# EasyEDA Pro project 鱼缸控制器(e-ink).epro, board Epad_C01_0603
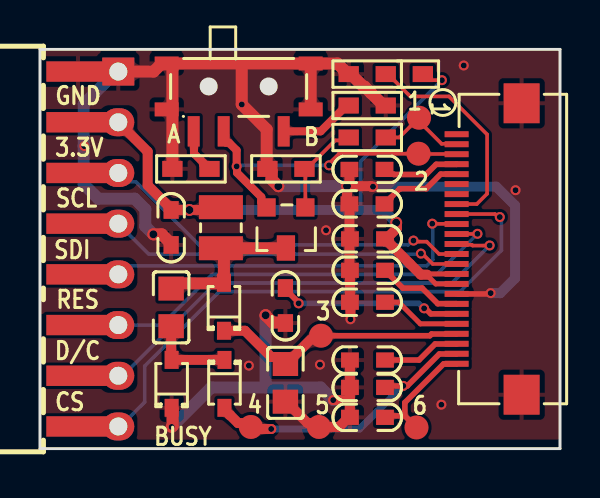
[diagram p8: board, top side]
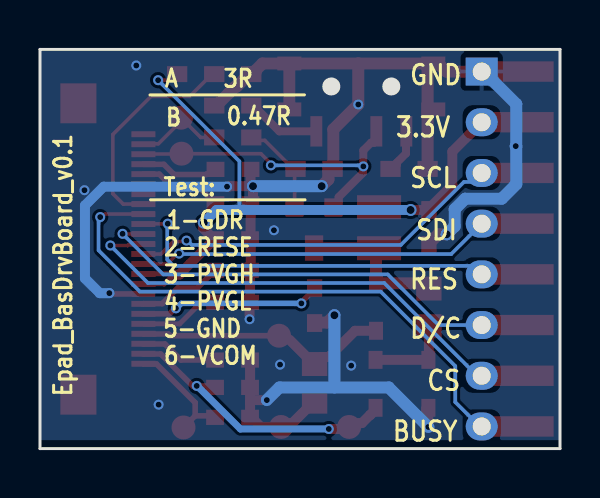
[diagram p9: board, bottom side, seen from below]

Outline 26 x 20 mm; copper layers: Top Layer, Bottom Layer. Coordinates in mm from the lower left corner of the outline.
Outline path: 0,20 0,0 26,0 26,20 0,20
Stack: Top Layer 0.0356mm / Dielectric 1 0.32mm FR-4 er 4.8 / Bottom Layer 0.0356mm

## Design rules (mm)
spacing safeClearance (default): track to track 0.25, other pairs 0 to 0.45
spacing BoardOutlineClearance: track to track 0.25, other pairs 0 to 0.45
spacing Clearance: track to track 0.25, other pairs 0 to 0.45
spacing Clearance_1: track to track 0.33, other pairs 0 to 0.45
spacing Clearance_2: track to track 0.33, other pairs 0 to 0.45
spacing Clearance_Room_LQFP: track to track 0.2, other pairs 0 to 0.45
spacing Clearance_Room_USB: track to track 0.2, other pairs 0 to 0.45
spacing Clearance_Room_FPC1: track to track 0.2, other pairs 0 to 0.45
track width Width (default): min 0.15, default 0.18, max 1
differential pair DiffPairsRouting (default): width min 0.381, default 0.381, max 0.381; gap min 0.254, default 0.254
via RoutingVias (default): diameter min 0.5, default 0.5, max 1; hole min 0.3, default 0.3, max 0.8

## Placement (name value [footprint] x y rotation side)
C1  1uF / NC  [C_մƬ(MLCC)_0603]  16.36 13.99 0 top
C2  1uF  [C_մƬ(MLCC)_0603]  16.36 12.26 0 top
C3  4.7uF 25V  [C_մƬ(MLCC)_0805]  6.56 7.08 90 top
C4  10uF  [C_մƬ(MLCC)_0603]  6.56 11.07 270 top
C5  4.7uF 25V  [C_մƬ(MLCC)_0805]  12.27 3.29 90 top
C6  1uF  [C_մƬ(MLCC)_0603]  16.36 10.51 180 top
C7  1uF  [C_մƬ(MLCC)_0603]  16.36 8.93 180 top
C8  1uF / NC  [C_մƬ(MLCC)_0603]  12.27 7.15 270 top
C9  1uF  [C_մƬ(MLCC)_0603]  16.36 7.33 180 top
C10  1uF  [C_մƬ(MLCC)_0603]  16.36 4.44 180 top
C11  1uF  [C_մƬ(MLCC)_0603]  16.36 3.06 180 top
C12  1uF  [C_մƬ(MLCC)_0603]  16.36 1.57 180 top
CN1  CN_FPC_24P  [CN_FPC_24P_0.5MM_½]  22.46 10 90 top
D1  MBR0530  [SOD-323]  9.22 3.24 270 top
D2  MBR0530  [SOD-323]  6.58 3.24 90 top
D3  MBR0530  [SOD-323]  9.2 7.1 90 top
J1  单排排针  [J__2.54_8x1P_SMD_]  1.9 10 270 top
J3  单排排针  [HDR-1X8(Pad_RR_1.4*1.6)]  3.91 18.89 270 top
L1  10uH 1A  [L_΢͹_2.5*2.0*1.2MM]  9.05 11.07 90 top
PAD1  0603  [Pad_ߺ_0603]  18.22 18.76 180 top
Q1  Si1308EDL  [SOT23-3(BHC)]  12.3 11.07 90 top
R1  3R  [R_Ƭ_0603]  16.36 18.76 0 top
R2  3R  [R_Ƭ_0603]  16.36 15.59 180 top
R3  10K  [R_Ƭ_0603]  12.3 14.01 0 top
R4  3R  [R_Ƭ_0603]  7.55 14.01 0 top
R5  0.47R  [R_Ƭ_0603]  16.36 17.19 180 top
SW1  SW_拨动开关_1P侧拨_SMD  [SW_ದ_SMD_MSK12CO2-SZ]  9.93 17.59 180 top
T1  TP-Pad圆点-TestPad  [TP-PadԲ_1.2_˿ӡ]  18.95 16.58 0 top
T2  TP-Pad圆点-TestPad  [TP-PadԲ_1.2_˿ӡ]  18.93 14.77 0 top
T3  TP-Pad圆点-TestPad  [TP-PadԲ_1.2_˿ӡ]  10.54 1.08 0 top
T4  TP-Pad圆点-TestPad  [TP-PadԲ_1.2_˿ӡ]  14.05 5.66 0 top
T5  TP-Pad圆点-TestPad  [TP-PadԲ_1.2_˿ӡ]  18.82 1.06 0 top
T6  TP-Pad圆点-TestPad  [TP-PadԲ_1.2_˿ӡ]  13.95 1.08 0 top

## Footprints (pads in the part's own frame, mm; a bottom-side part is the same pattern mirrored in y, then rotated)
C_մƬ(MLCC)_0603
  rect 0.889x0.762 smd: 1(-0.889,0) 2(0.864,0)
C_մƬ(MLCC)_0805
  rect 1.2x1.27 smd: 1(-0.943,0) 2(0.943,0)
CN_FPC_24P_0.5MM_½
  rect 0.3x1.2 smd: 1(5.75,1.625) 2(5.25,1.625) 3(4.75,1.625) 4(4.25,1.625) 5(3.75,1.625) 6(3.25,1.625) 7(2.75,1.625) 8(2.25,1.625) 9(1.75,1.625) 10(1.25,1.625) 11(0.75,1.625) 12(0.25,1.625) 13(-0.25,1.625) 14(-0.75,1.625) 15(-1.25,1.625) 16(-1.75,1.625) 17(-2.25,1.625) 18(-2.75,1.625) 19(-3.25,1.625) 20(-3.75,1.625) 21(-4.25,1.625) 22(-4.75,1.625) 23(-5.25,1.625) 24(-5.75,1.625)
  rect 2x1.8 smd: 25(-7.3,-1.625) 26(7.3,-1.625)
HDR-1X8(Pad_RR_1.4*1.6)
  rect 1.4x1.6 hole 0.9: 1(0,0)
  rrect 1.4x1.6 hole 0.9: 2(2.54,0) 3(5.08,0) 4(7.62,0) 5(10.16,0) 6(12.7,0) 7(15.24,0) 8(17.78,0)
J__2.54_8x1P_SMD_
  rect 1.02x3.17 smd: 1(-8.89,0) 2(-6.35,0) 3(-3.81,0) 4(-1.27,0) 5(1.27,0) 6(3.81,0) 7(6.35,0) 8(8.89,0)
L_΢͹_2.5*2.0*1.2MM
  rect 1.2x2.2 smd: 1(1.028,0) 2(-1.028,0)
Pad_ߺ_0603
  rect 1.016x0.8 smd: 1(-0.927,0)
R_Ƭ_0603
  rect 1.016x0.8 smd: 1(-0.927,0) 2(0.927,0)
SOD-323
  rect 0.899x0.701 smd: 1(1.2,0) 2(-1.2,0)
SOT23-3(BHC)
  rect 0.914x0.914 smd: 1(1.016,-0.971) 2(1.016,0.971)
  rect 1.27x0.914 smd: 3(-1.016,0)
SW_ದ_SMD_MSK12CO2-SZ
  rect 0.6x1.524 smd: 1(-2.25,1.7) 2(0.75,1.7) 3(2.25,1.7)
  rect 1.2x0.7 smd: 4(-3.6,0.6) 4(-3.6,-1.7) 4(3.6,0.6) 4(3.6,-1.7)
TP-PadԲ_1.2_˿ӡ
  round 1.2 smd: 1(0,0)

## Nets
As in the schematic.

Pads without a net: CN1 1 6 7

## Via types
v1: diameter 0.5, hole 0.3, Top Layer to Bottom Layer, 26 vias
v2: diameter 0.6, hole 0.4, Top Layer to Bottom Layer, 6 vias

## Routing (per net, layer and track width the routed paths; a pad name or vN(x,y) marks a point on that pad's centre or on a via; arc(x,y) is an arc through that point)
GND: length 90.8
  Top Layer w0.28: CN1.17 22.44,7.75
  Top Layer w0.3: 22.44,7.75 22.48,7.79 v1(22.53,7.79)
  Top Layer w0.5: 15.5,2.32 C12.2 15.43,1.57 14.95,1.08 T6.1 13.75,1.28 13.38,1.28 12.31,2.35 C5.1 ; 15.5,2.32 C11.2 C10.2 ; 15.5,2.32 15.38,2.43 v1(14.66,2.43) ; 15.47,13.15 16.53,13.15 16.56,13.12 v1(16.65,13.12) ; 15.47,13.15 v2(15.35,13.15) 15.35,12.38 C2.1 15.47,8.96 C7.2 C9.2 15.52,7.31 15.52,6.68 ; 15.47,13.15 C1.1
  Top Layer w0.6: C8.2 12.25,6.32 11.63,6.32 11.28,6.67 v2(11.28,6.68) ; R4.1 6.62,19.24 6.57,19.29 ; SW1.4 14.87,19.29 15.23,18.94 15.23,18.86 15.33,18.76 R1.1 15.54,18.76 16.17,18.14 16.23,18.14 16.55,17.81 16.56,17.81 17.18,17.19 R5.1 ; SW1.4 SW1.4 ; SW1.4 10.09,19.29 ; 10.09,19.29 6.57,19.29 ; 10.09,19.29 v1(10.09,17.24) 11.33,15.99 11.33,14.05 R3.1 11.48,14.01 11.58,13.91 11.58,13.49 v2(11.92,13.15) ; v1(6.58,1.08) 6.63,1.13 6.63,1.99 D2.2 ; 6.57,19.29 SW1.4 6.08,19.29 5.68,18.89 J3.1 ; v2(5.67,10.74) 6.09,10.74 6.56,10.27 C4.2
  Bottom Layer w0.5: v1(16.65,13.12) 22.81,13.12 23.75,12.18 23.75,8.53 23.02,7.79 v1(22.53,7.79)
  Bottom Layer w0.6: 11.28,3.06 v2(11.28,6.68) ; 11.28,3.06 8.56,3.06 v1(6.58,1.08) ; 11.28,3.06 14.02,3.06 v1(14.66,2.43) ; v2(11.92,13.15) v2(15.35,13.15) ; v2(5.67,10.74) 5.26,11.14 5.26,11.99 4.74,12.52 2.91,12.52 2.19,13.25 2.19,15.13 v1(2.21,15.16) 2.19,15.18 2.19,17.26 3.81,18.89 J3.1
  vias: v1(10.44,4.16) v1(14,4.21) v1(14.3,10.94) v1(15.52,6.48) v1(20.07,2.2) v1(21.19,19.19) v1(23.78,12.95)
VCC3.3: length 35.2
  Top Layer w0.18: PAD1.1 19.45,18.46 v1(20.09,18.46)
  Top Layer w0.25: CN1.16 19.79,8.25 19.36,8.68 19.43,8.75 CN1.15
  Top Layer w0.3: v2(17.81,11.32) 17.84,11.29 ; 19.34,8.7 19.36,8.68
  Top Layer w0.5: C6.1 17.31,10.51 ; 17.31,10.51 17.44,10.38 17.44,10.31 19.04,8.71 19.36,8.71 ; 17.31,10.51 17.84,11.04 17.84,11.29 ; L1.1 8.91,11.95 v2(7.47,11.95) C4.1 6.56,12.02 5.38,13.19 5.38,14.88 J3.2
  Bottom Layer w0.18: v1(20.09,18.46) 16.03,14.39 16.03,11.95
  Bottom Layer w0.5: v2(7.47,11.95) 17.17,11.95 v2(17.81,11.32) 17.78,11.32 17.69,11.41
BUSY: length 27.8
  Top Layer w0.18: CN1.9 22.75,11.75 22.9,11.6 v1(22.99,11.6)
  Bottom Layer w0.18: J3.8 4.01,1.11 5.24,2.33 5.24,4.14 8.97,7.87 21,7.87 23.07,9.93 23.07,11.52 v1(22.99,11.6)
CS: length 23
  Top Layer w0.18: CN1.12 20.87,10.21 21.59,10.21 21.63,10.17 22.48,10.17 v1(22.48,10.18)
  Bottom Layer w0.18: J3.7 4.14,3.65 8.79,8.3 20.6,8.3 v1(22.48,10.18)
D/C: length 20.9
  Top Layer w0.18: v1(21.87,10.76) 21.87,10.76 20.84,10.76 CN1.11
  Bottom Layer w0.18: J3.6 6.07,6.19 8.61,8.73 19.84,8.73 v1(21.87,10.76)
GDR: length 4.6
  Top Layer w0.18: R2.1 17.96,15.59 T1.1 18.95,16.4 20.08,15.27 20.81,15.27 CN1.2
NETC1_2: length 3.9
  Top Layer w0.28: C1.2 17.29,13.99 17.53,13.75 17.68,13.75 17.69,13.73 19.3,13.73 19.81,14.24 20.82,14.24 CN1.4
NETC2_2: length 4.3
  Top Layer w0.28: CN1.5 20.03,13.75 19.31,13.02 17.99,13.02 17.53,12.56 17.53,12.5 17.29,12.26 C2.2
NETC3_1: length 4.3
  Top Layer w0.18: 6.56,4.47 D2.1
  Top Layer w0.5: 6.56,4.47 C3.1 ; D2.1 D1.2
NETC3_2: length 7.8
  Top Layer w0.6: C3.2 6.82,8.28 9.2,8.28 D3.1 9.2,9.89 L1.2 12.28,10.04 Q1.3
NETC7_1: length 4.3
  Top Layer w0.28: C7.1 17.31,8.93 17.55,8.69 17.55,8.63 18.14,8.04 19.1,8.04 19.89,7.26 20.82,7.26 CN1.18
NETC8_1: length 9.1
  Top Layer w0.18: 12.27,7.98 C8.1
  Top Layer w0.28: v1(19.21,7.03) 19.26,7.03 19.54,6.75 CN1.19 ; v1(12.93,7.28) 12.93,7.32 12.27,7.98
  Bottom Layer w0.28: 12.95,7.28 18.93,7.28 19.18,7.03 v1(19.21,7.03)
NETC9_1: length 4
  Top Layer w0.25: CN1.20 19.02,6.25 17.94,7.33 C9.1
NETC10_1: length 3.9
  Top Layer w0.28: CN1.22 20.82,5.24 19.75,5.24 18.95,4.44 C10.1
NETCN1_8: length 11
  Top Layer w0.18: CN1.8 21.84,12.25 22.35,12.77 22.35,15.74 20.45,17.64 18.51,17.64 17.4,18.76 R1.2
NETQ1_1: length 4.7
  Top Layer w0.18: R2.2 15.29,15.44 14.76,15.44 13.33,14.01 R3.2 ; Q1.1 13.27,13.97
NETR4_2: length 2.3
  Top Layer w0.4: R4.2 8.37,14.01 8.17,14.21 8.17,14.32 7.7,14.79 7.7,15.88 SW1.3
NETR5_2: length 3.8
  Top Layer w0.4: R5.2 15.33,17.19 14.03,15.89 SW1.1
PREVGH: length 13
  Top Layer w0.28: CN1.21 20.82,5.74 19.58,5.74 19.49,5.66 T4.1 13.85,5.46 13.53,5.46 ; C5.2 12.31,4.24
  Top Layer w0.5: C5.2 11.92,4.59 11.56,4.59 10.25,5.9 D3.2 ; 12.31,4.24 13.53,5.46
PREVGL: length 14.7
  Top Layer w0.28: C11.1 17.33,3.14 v1(18.16,3.14) 18.37,3.14 19.97,4.74 20.82,4.74 CN1.23
  Top Layer w0.35: v1(18.16,3.14) 18.19,3.17
  Top Layer w0.5: v1(11.56,0.98) 10.65,0.98 T3.1 10.35,1.28 9.9,1.28 9.5,1.68 9.48,1.68 9.22,1.94 D1.1
  Bottom Layer w0.35: v1(11.56,0.98) 15.98,0.98 18.14,3.14 v1(18.16,3.14)
RES: length 19.1
  Top Layer w0.18: v1(19.61,11.27) 19.62,11.26 20.82,11.26 CN1.10
  Bottom Layer w0.18: J3.5 4.34,9.16 19.33,9.16 19.64,9.47 19.64,11.24 v1(19.61,11.27)
RESE: length 16.1
  Top Layer w0.18: CN1.3 20.82,14.76 18.94,14.76 T2.1 14.95,14.77 14.52,14.34 14.52,14.25 v1(14.46,14.19)
  Top Layer w0.4: v1(9.83,14.14) 9.83,14.94 9.44,15.33 9.28,15.33 9.18,15.43 SW1.2 ; 9.84,14.11 9.85,14.09 9.85,13.82 11.07,12.6 11.07,12.34 Q1.2
  Bottom Layer w0.18: v1(14.46,14.19) 9.88,14.19 v1(9.83,14.14)
SCLK: length 18.8
  Top Layer w0.18: v1(18.67,10.42) 18.73,10.37 19.33,10.37 19.95,9.75 20.83,9.75 CN1.13
  Bottom Layer w0.18: v1(18.67,10.42) 18.63,10.42 18.41,10.2 7.96,10.2 4.8,13.36 4.36,13.36 J3.3
SDI: length 17.8
  Top Layer w0.18: v1(19.05,9.77) 19.11,9.77 19.63,9.25 CN1.14
  Bottom Layer w0.18: J3.4 5.44,9.75 19.02,9.75 v1(19.05,9.77)
VCOM: length 5.9
  Top Layer w0.28: 18.24,1.64 T5.1 ; 18.24,1.64 17.32,1.64 C12.1 ; 18.24,1.64 18.24,2.31 20.18,4.24 20.82,4.24 CN1.24

## Copper pours and planes (outline as drawn; the poured copper is in the pictures)
GND on Top Layer: 0,0.44 0,20 26,20 26,0.45
GND on Bottom Layer: 0,0.42 0,20 26,20 26,0.42

Small or netless copper shapes (teardrops, artwork), in the pictures only: 89 on Top Layer, 22 on Bottom Layer

## Text on the board
Bottom Silkscreen Layer: B | A | Epad_BasDrvBoard_v0.1 | 0.47R | 3R | 1-GDR | 2-RESE | 3-PVGH | 4-PVGL | 6-VCOM | Test: | 5-GND | CS | SDI | GND | SCL | RES | D/C | 3.3V | BUSY
Mechanical Layer: 最小线宽：0.18mm； | 最小过孔：0.3/0.5mm； | 最小线隙：0.25mm； | 板型尺寸：26 x 20 | 本板工艺：
Top Silkscreen Layer: A | 4 | B | 5 | 3 | 1 | 6 | 2 | SDI | D/C | 3.3V | CS | GND | SCL | RES | BUSY
